# Altium schematic sheet Keypadmacro.SchDoc
size 419 x 297 mm
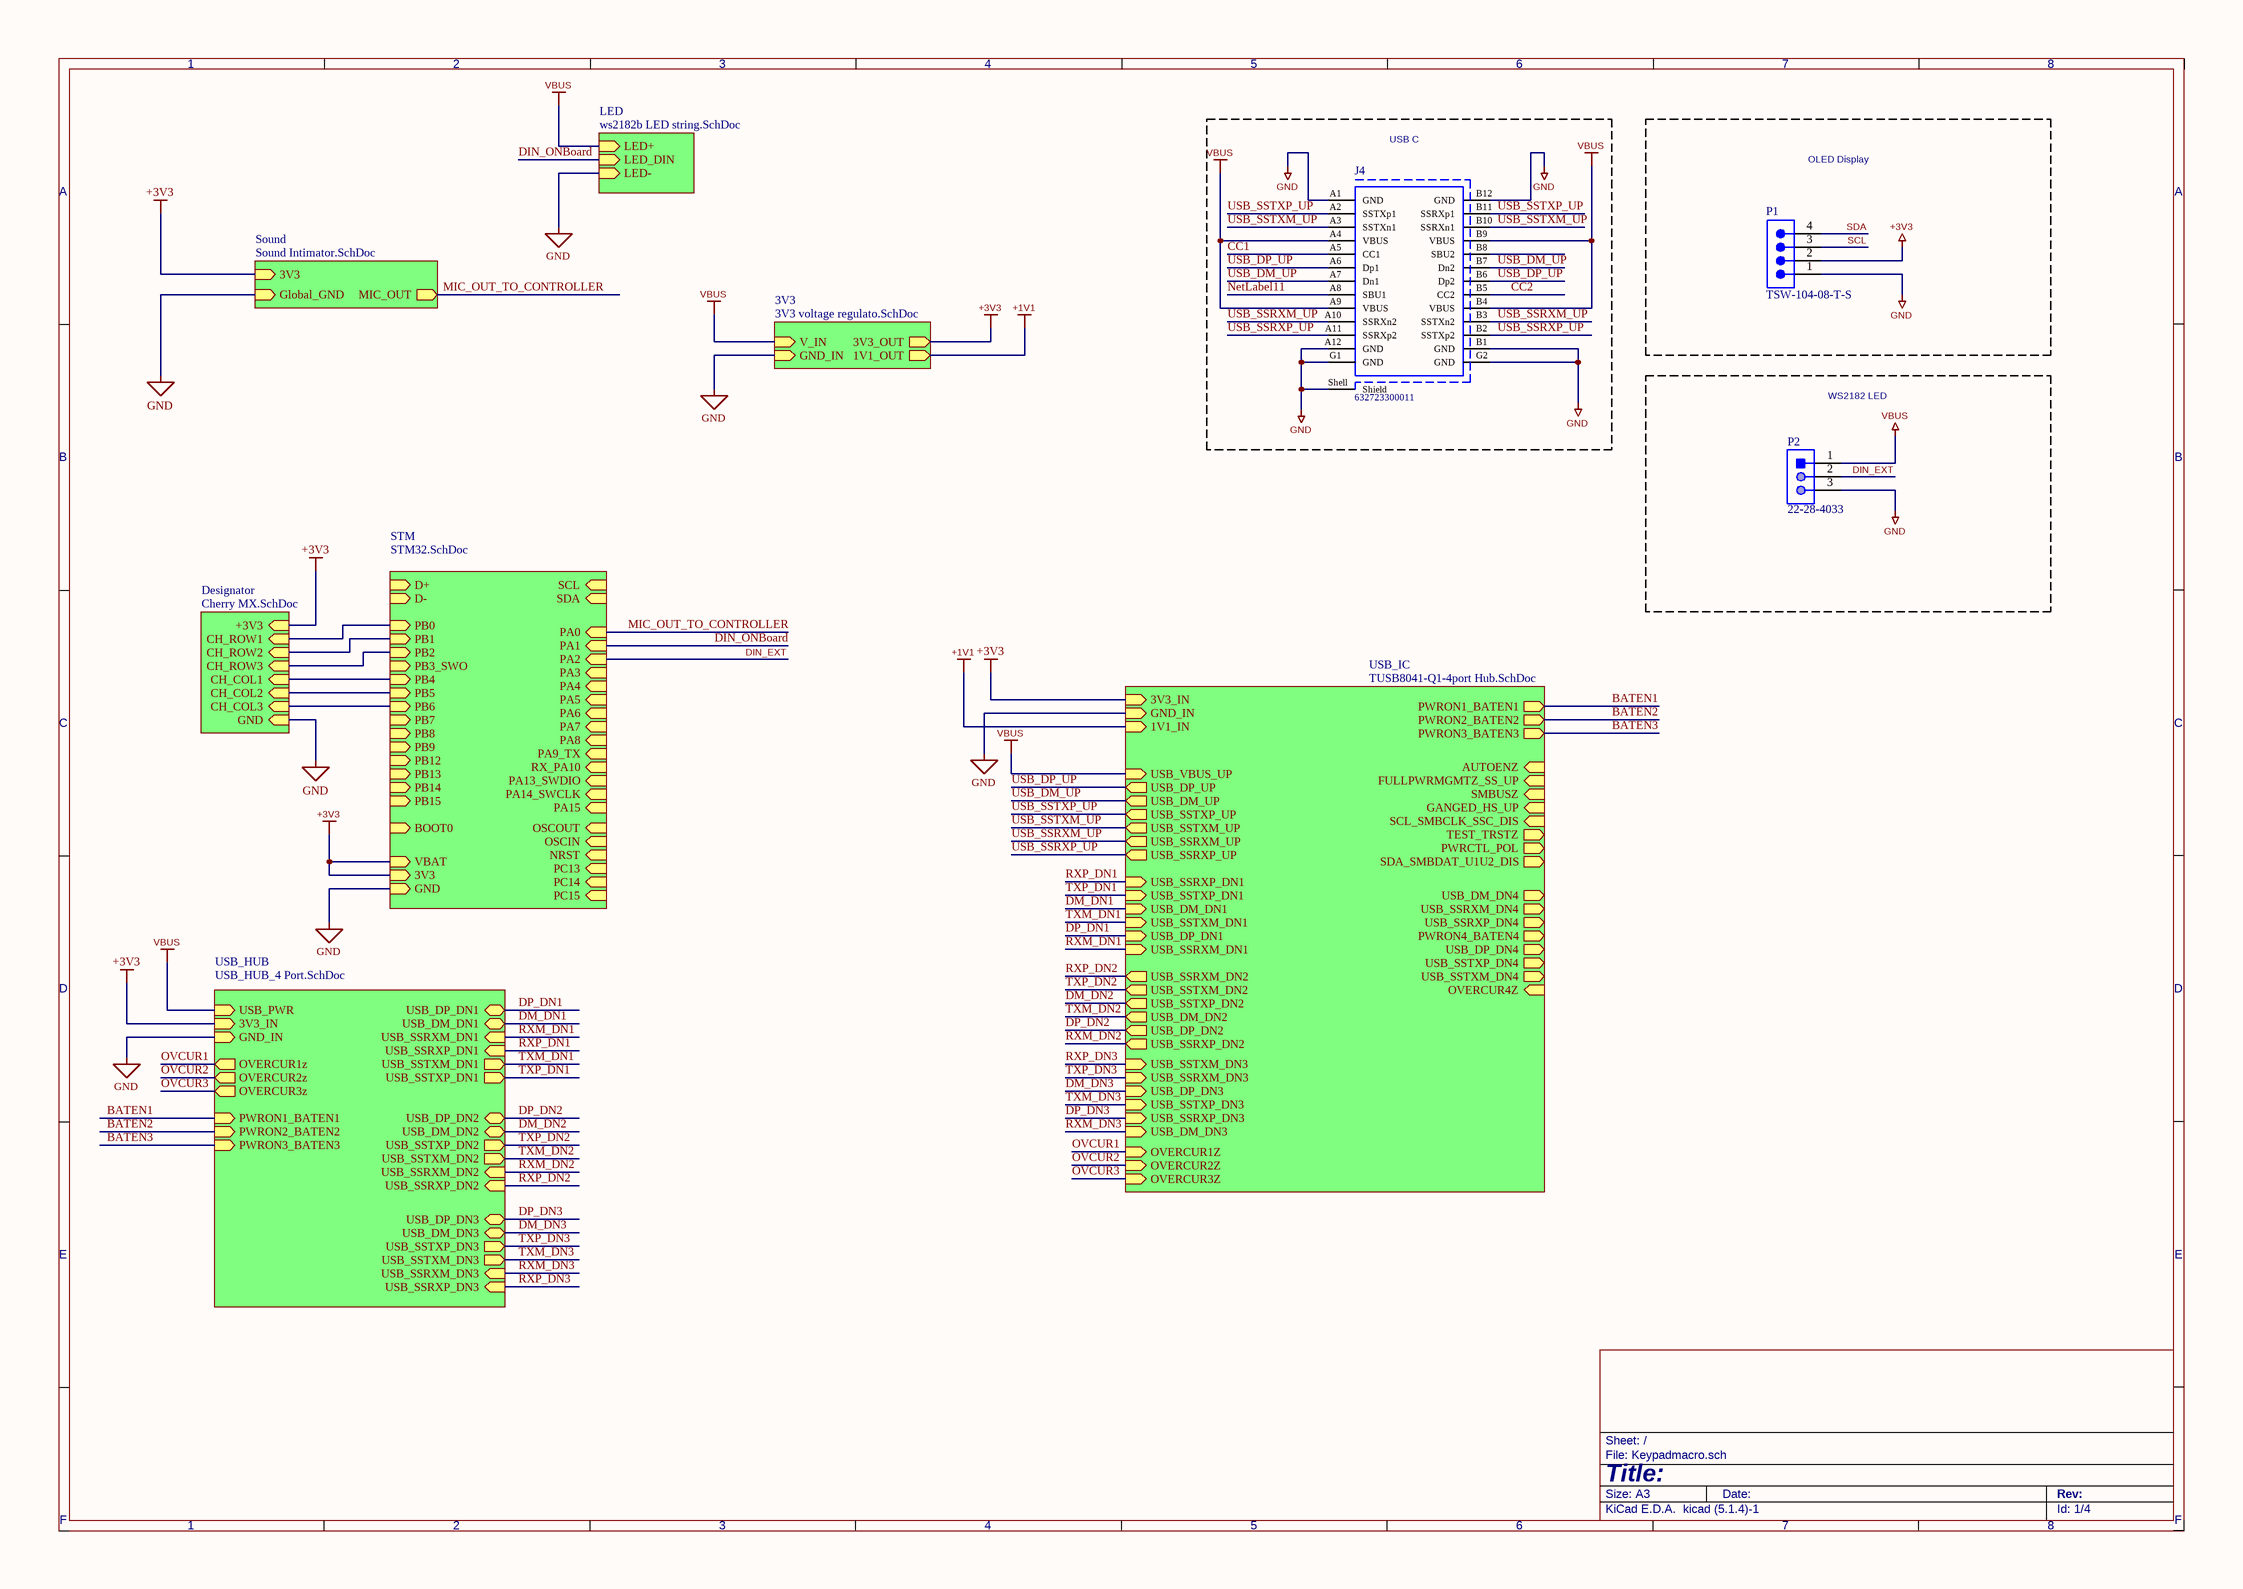
[diagram p0: Keypadmacro.SchDoc]

## Parts
J4  632723300011  [632723300011]
P1  TSW-104-08-T-S  [SMTC-TSW-104-08-X-S]
P2  22-28-4033  [MOLX-22-28-4033_V]

## Blocks framed on the sheet
USB C: J4
OLED Display: P1
WS2182 LED: P2

## Sub-sheets
3V3 = 3V3 voltage regulato.SchDoc: 3V3_OUT (out), GND_IN (in), V_IN (in), 1V1_OUT (out)
Designator = Cherry MX.SchDoc: CH_ROW2 (in), CH_COL3 (in), CH_ROW3 (in), GND (in), +3V3 (in), CH_COL2 (in), CH_ROW1 (in), CH_COL1 (in)
LED = ws2182b LED string.SchDoc: LED+ (in), LED_DIN (in), LED- (in)
Sound = Sound Intimator.SchDoc: 3V3 (in), Global_GND (in), MIC_OUT (out)
STM = STM32.SchDoc: 3V3 (in), VBAT (in), GND (in), D+ (in), D- (in), BOOT0 (in), NRST (in), PA0 (in), PA9_TX (in), PA6 (in), PA7 (in), PA1 (in), PA5 (in), PA3 (in), PA2 (in), PA4 (in), PA8 (in), PB13 (in), PB6 (in), PB9 (in), PB12 (in), PB14 (in), PB0 (in), PB4 (in), PB3_SWO (in), PB1 (in), PB8 (in), PB15 (in), PB5 (in), PB2 (in), PB7 (in), RX_PA10 (in), PC14 (in), PC15 (in), PA15 (in), PC13 (in), SCL (in), OSCIN (in), SDA (in), PA13_SWDIO (in), PA14_SWCLK (in), OSCOUT (in)
USB_HUB = USB_HUB_4 Port.SchDoc: USB_PWR (in), 3V3_IN (in), OVERCUR3z (out), OVERCUR1z (out), OVERCUR2z (out), PWRON2_BATEN2 (in), PWRON1_BATEN1 (in), PWRON3_BATEN3 (in), GND_IN (in), USB_DM_DN1 (bidir), USB_SSTXM_DN3 (out), USB_SSTXM_DN1 (out), USB_SSRXP_DN1 (in), USB_SSTXP_DN3 (out), USB_SSTXM_DN2 (out), USB_SSRXM_DN2 (in), USB_SSRXM_DN3 (in), USB_SSRXP_DN3 (in), USB_DM_DN2 (bidir), USB_DM_DN3 (bidir), USB_DP_DN1 (bidir), USB_SSTXP_DN1 (out), USB_DP_DN2 (bidir), USB_SSRXP_DN2 (in), USB_DP_DN3 (bidir), USB_SSTXP_DN2 (out), USB_SSRXM_DN1 (in)
USB_IC = TUSB8041-Q1-4port Hub.SchDoc: GND_IN (in), USB_SSRXP_DN3 (in), USB_DM_DN3 (in), USB_SSTXM_DN3 (in), 1V1_IN (in), PWRON4_BATEN4 (out), USB_SSRXP_DN4 (out), USB_SSTXP_DN3 (in), USB_DP_DN3 (in), 3V3_IN (in), USB_DM_DN4 (out), USB_DP_DN4 (out), USB_SSRXM_DN4 (out), USB_SSTXM_DN4 (out), USB_SSTXP_DN4 (out), USB_SSRXM_DN3 (in), USB_VBUS_UP (in), PWRON3_BATEN3 (out), PWRON2_BATEN2 (out), PWRON1_BATEN1 (out), SDA_SMBDAT_U1U2_DIS (out), USB_SSRXP_UP (out), USB_SSTXP_DN1 (in), USB_SSRXM_UP (out), USB_SSRXP_DN1 (in), USB_SSRXM_DN1 (in), USB_DP_DN1 (in), USB_SSTXP_UP (out), USB_DM_UP (out), OVERCUR2Z (in), OVERCUR1Z (in), TEST_TRSTZ (out), USB_DP_UP (out), USB_SSTXM_DN1 (in), USB_DM_DN1 (in), USB_SSTXM_UP (out), USB_DP_DN2 (out), USB_DM_DN2 (out), USB_SSTXP_DN2 (out), SCL_SMBCLK_SSC_DIS (in), USB_SSTXM_DN2 (out), USB_SSRXP_DN2 (out), USB_SSRXM_DN2 (out), AUTOENZ (in), OVERCUR3Z (in), GANGED_HS_UP (in), OVERCUR4Z (in), PWRCTL_POL (out), FULLPWRMGMTZ_SS_UP (in), SMBUSZ (in)

## Nets
+1V1: sheet 3V3/1V1_OUT, sheet USB_IC/1V1_IN
+3V3: P1.2 ; sheet Sound/3V3, sheet STM/3V3, sheet STM/VBAT, sheet Designator/+3V3, sheet 3V3/3V3_OUT, sheet USB_HUB/3V3_IN, sheet USB_IC/3V3_IN
GND: J4.A1(GND) J4.A12(GND) J4.B1(GND) J4.B12(GND) J4.G1(GND) J4.G2(GND) J4.Shell(Shield) P1.1 P2.3 ; sheet Sound/Global_GND, sheet STM/GND, sheet Designator/GND, sheet 3V3/GND_IN, sheet LED/LED-, sheet USB_HUB/GND_IN, sheet USB_IC/GND_IN
VBUS: J4.A4(VBUS) J4.A9(VBUS) J4.B4(VBUS) J4.B9(VBUS) P2.1 ; sheet 3V3/V_IN, sheet LED/LED+, sheet USB_HUB/USB_PWR, sheet USB_IC/USB_VBUS_UP
BATEN1: sheet USB_HUB/PWRON1_BATEN1, sheet USB_IC/PWRON1_BATEN1
BATEN2: sheet USB_HUB/PWRON2_BATEN2, sheet USB_IC/PWRON2_BATEN2
BATEN3: sheet USB_HUB/PWRON3_BATEN3, sheet USB_IC/PWRON3_BATEN3
CC1: J4.A5(CC1)
CC2: J4.B5(CC2)
DIN_EXT: P2.2 ; sheet STM/PA2
DIN_ONBoard: sheet STM/PA1, sheet LED/LED_DIN
DM_DN1: sheet USB_HUB/USB_DM_DN1, sheet USB_IC/USB_DM_DN1
DM_DN2: sheet USB_HUB/USB_DM_DN2, sheet USB_IC/USB_SSTXP_DN2
DM_DN3: sheet USB_HUB/USB_DM_DN3, sheet USB_IC/USB_DP_DN3
DP_DN1: sheet USB_HUB/USB_DP_DN1, sheet USB_IC/USB_DP_DN1
DP_DN2: sheet USB_HUB/USB_DP_DN2, sheet USB_IC/USB_DP_DN2
DP_DN3: sheet USB_HUB/USB_DP_DN3, sheet USB_IC/USB_SSRXP_DN3
MIC_OUT_TO_CONTROLLER: sheet Sound/MIC_OUT, sheet STM/PA0
NetLabel11: J4.A8(SBU1)
OVCUR1: sheet USB_HUB/OVERCUR1z, sheet USB_IC/OVERCUR1Z
OVCUR2: sheet USB_HUB/OVERCUR2z, sheet USB_IC/OVERCUR2Z
OVCUR3: sheet USB_HUB/OVERCUR3z, sheet USB_IC/OVERCUR3Z
RXM_DN1: sheet USB_HUB/USB_SSRXM_DN1, sheet USB_IC/USB_SSRXM_DN1
RXM_DN2: sheet USB_HUB/USB_SSRXM_DN2, sheet USB_IC/USB_SSRXP_DN2
RXM_DN3: sheet USB_HUB/USB_SSRXM_DN3, sheet USB_IC/USB_DM_DN3
RXP_DN1: sheet USB_HUB/USB_SSRXP_DN1, sheet USB_IC/USB_SSRXP_DN1
RXP_DN2: sheet USB_HUB/USB_SSRXP_DN2, sheet USB_IC/USB_SSRXM_DN2
RXP_DN3: sheet USB_HUB/USB_SSRXP_DN3, sheet USB_IC/USB_SSTXM_DN3
SCL: P1.3
SDA: P1.4
TXM_DN1: sheet USB_HUB/USB_SSTXM_DN1, sheet USB_IC/USB_SSTXM_DN1
TXM_DN2: sheet USB_HUB/USB_SSTXM_DN2, sheet USB_IC/USB_DM_DN2
TXM_DN3: sheet USB_HUB/USB_SSTXM_DN3, sheet USB_IC/USB_SSTXP_DN3
TXP_DN1: sheet USB_HUB/USB_SSTXP_DN1, sheet USB_IC/USB_SSTXP_DN1
TXP_DN2: sheet USB_HUB/USB_SSTXP_DN2, sheet USB_IC/USB_SSTXM_DN2
TXP_DN3: sheet USB_HUB/USB_SSTXP_DN3, sheet USB_IC/USB_SSRXM_DN3
USB_DM_UP: J4.A7(Dn1) J4.B7(Dn2) ; sheet USB_IC/USB_DM_UP
USB_DP_UP: J4.A6(Dp1) J4.B6(Dp2) ; sheet USB_IC/USB_DP_UP
USB_SSRXM_UP: J4.A10(SSRXn2) J4.B3(SSTXn2) ; sheet USB_IC/USB_SSRXM_UP
USB_SSRXP_UP: J4.A11(SSRXp2) J4.B2(SSTXp2) ; sheet USB_IC/USB_SSRXP_UP
USB_SSTXM_UP: J4.A3(SSTXn1) J4.B10(SSRXn1) ; sheet USB_IC/USB_SSTXM_UP
USB_SSTXP_UP: J4.A2(SSTXp1) J4.B11(SSRXp1) ; sheet USB_IC/USB_SSTXP_UP
(unnamed): sheet STM/PB6, sheet Designator/CH_COL3
(unnamed): sheet STM/PB0, sheet Designator/CH_ROW1
(unnamed): sheet STM/PB4, sheet Designator/CH_COL1
(unnamed): sheet STM/PB1, sheet Designator/CH_ROW2
(unnamed): sheet STM/PB5, sheet Designator/CH_COL2
(unnamed): sheet STM/PB2, sheet Designator/CH_ROW3

Not connected (* = marked no-connect by the designer): J4 B8(SBU2)

## Notes on the sheet
- 1
- 2
- 3
- 4
- 5
- 6
- 7
- 8
- A
- B
- C
- D
- E
- Title:
- File: Keypadmacro.sch
- Sheet: /
- F
- KiCad E.D.A.  kicad (5.1.4)-1
- Size: A3
- Date:
- Rev:
- Id: 1/4

## Library data of the parts
J4 = CMP-1502-03214-1: USB 3.1 Type C Receptacle WR-COM, Horizontal, SMT / THT; Manufacturer: Wurth Elektronik; Rated Current: 5A; Contact Resistance: 30mOhm; Working Voltage: 20VDC; Operating Temperature: -40to105degC; Package Reference: 632723300011; Datasheet URL: https://katalog.we-online.de/em/datasheet/632723x00011%282%29.pdf; Manufacturer URL: http://www.we-online.de; Connector Type: USB3.1TypeC; Gender: Receptacle; Part Number: 632723300011; Mounting Technology: SMT/THT; Publisher: WurthElektronik; Packaging: TapeandReel; Orientation: Horizontal
P1 = CMP-1024-00356-1: 0.025" SQ Post Header, Through-hole, Vertical, -55 to 105 degC, 2.54 mm Pitch, 4-Pin, Male, RoHS; Manufacturer: Samtec; Pitch: 2.54 mm; PackageDescription: .025[0.64] SQ. Post Terminal Strip Assembly; ComponentLink2URL: http://www.samtec.com/documents/webfiles/pdf/TSW_TH.PDF; ComponentLink3URL: http://www.samtec.com/documents/webfiles/cpdf/TSW-XXX-XX-XXX-X-XX-XXX-MKT.pdf; PackageVersion: DM, 8/1988; ComponentLink3Description: Package Specification; DatasheetVersion: F-214; Orientation: Vertical; RoHS: True; Mounting Technology: Through-hole; ComponentLink1URL: http://www.samtec.com; PartNumber: TSW-104-08-T-S; ComponentLink1Description: Manufacturer URL; Temperature Range: -55 to 105 degC; ComponentLink2Description: Datasheet; PackageReference: TSW-104-08-X-S
P2 = CMP-1676-00001-5: Male Header, Pitch 2.54 mm, 1 x 3 Position, Height 8.38 mm, Tail Length 3.18 mm, RoHS, Bulk; Manufacturer: Molex; Rows: 1; Voltage Rating: 250 V; Current Rating: 4 A; Min Operating Temperature: 0 degC; Lead Pitch: 0.1 inch; Packaging: Bulk; Contact Finish: Gold; RoHSCompliant: true; Contact Material: Brass; PackageReference: 22-28-4033; REACH SVHC: Unknown; PackageDescription: Male Header, Pitch 2.54 mm, 1 x 3 Position, Height 8.38 mm, Tail Length 3.18 mm; ComponentLink2URL: http://www.molex.com/pdm_docs/sd/022284033_sd.pdf; Height: 8.38 mm; Mounting Technology: Through Hole; ComponentLink1Description: Manufacturer URL; Length: 7.62 mm; Mount: Through Hole; DatasheetVersion: Rev. G, 01/2012; Max Operating Temperature: 75 degC; ComponentLink2Description: Datasheet; Colour: Black; Pins: 3; Contact Plating: Gold; Package Quantity: 1; ComponentLink1URL: http://www.molex.com/